# EAGLE design programmer (EAGLE 5.06)
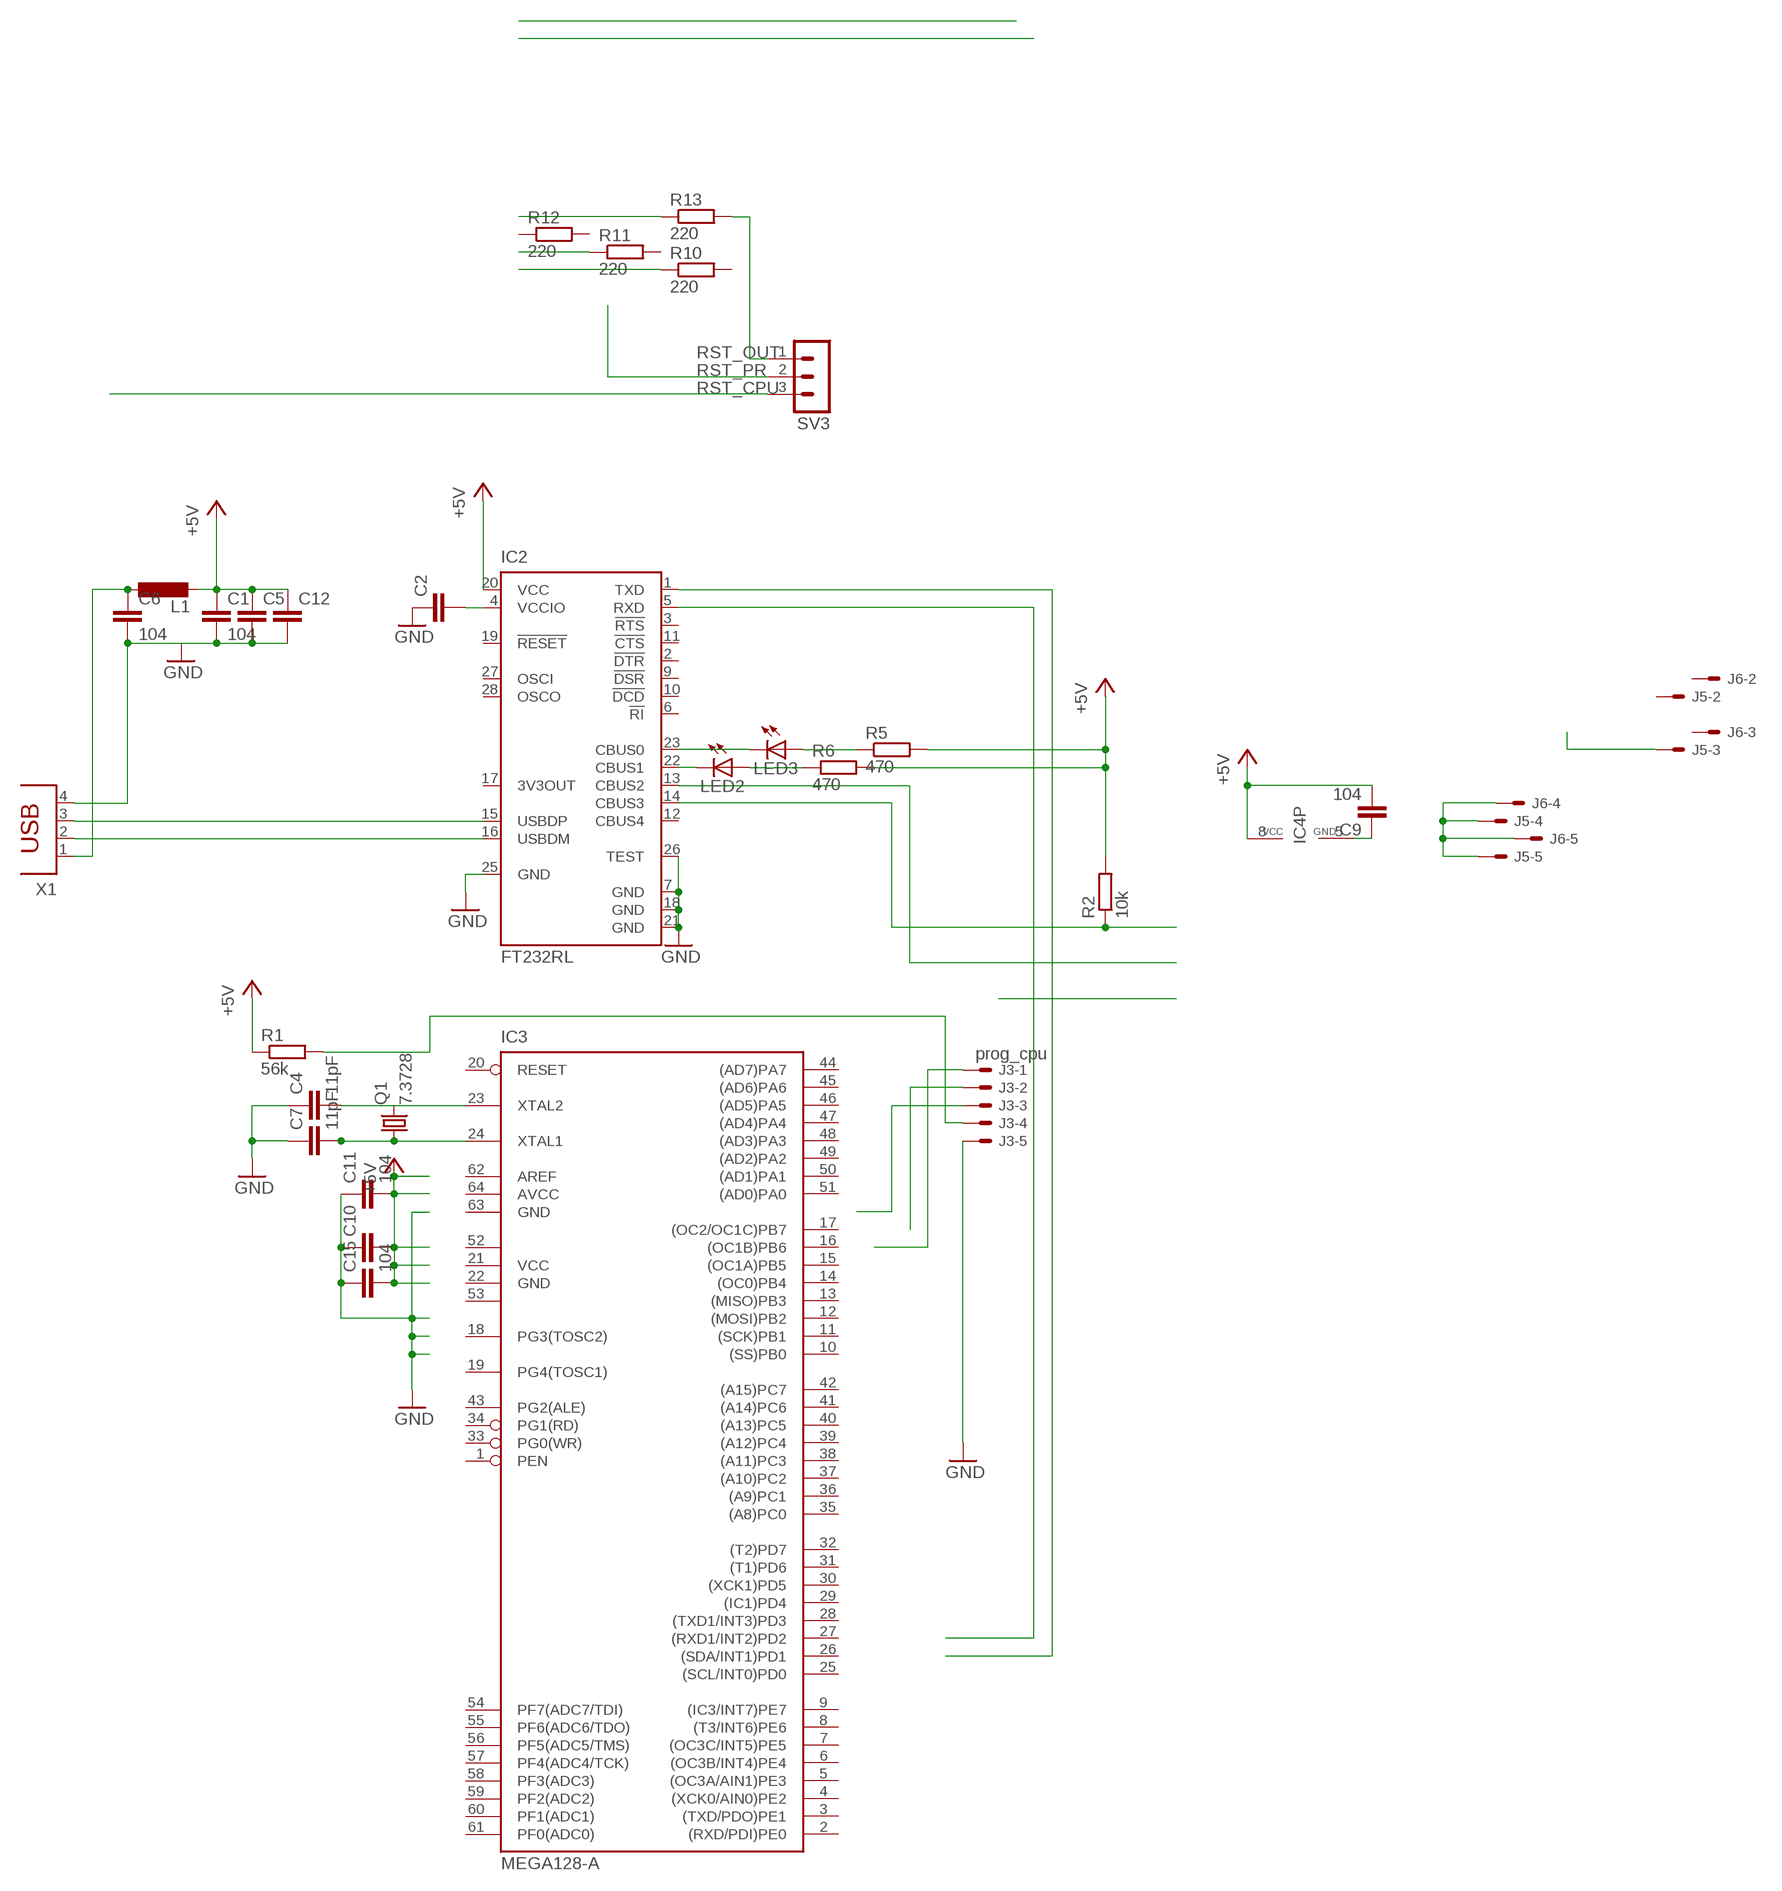
[diagram p0: schematic, sheet 1]

## Parts
C1  104  C-EUC1206  [C1206]
C2  C-EUC1206  [C1206]
C4  11pF  C-EUC1206  [C1206]
C5  C-EUC1206  [C1206]
C6  104  C-EUC1206  [C1206]
C7  11pF  C-EUC1206  [C1206]
C9  104  C-EUC1206  [C1206]
C10  C-EUC1206  [C1206]
C11  104  C-EUC1206  [C1206]
C12  C-EU025-050X050  [C025-050X050]
C15  104  C-EUC1206  [C1206]
IC2  FT232RL  [SSOP28]
IC3  MEGA128-A  [TQFP64]
IC4  MAX481  MAX481CSA  [SO08]
J3  prog_cpu  22-27-2051-05  [6410-05]
J5  22-05-7088-08  [7395-08]
J6  22-27-2081-08  [6410-08]
L1  L-EUL4532C  [L4532M]
LED2  LEDSMT1206  [1206]
LED3  LEDSMT1206  [1206]
Q1  7.3728  CRYTALHC49S  [HC49/S]
R1  56k  R-EU_R1206  [R1206]
R2  10k  R-EU_R1206  [R1206]
R5  470  R-EU_R1206  [R1206]
R6  470  R-EU_R1206  [R1206]
R10  220  R-EU_R1206  [R1206]
R11  220  R-EU_R1206  [R1206]
R12  220  R-EU_R1206  [R1206]
R13  220  R-EU_R1206  [R1206]
SV3  MA03-1  [MA03-1]
X1  PN61729  [PN61729]

## Nets
+5V: C1.1 C5.1 C9.2 C10.2 C11.2 C12.1 C15.2 IC2.20(VCC) IC4.8(VCC) L1.2 R1.1 R2.2 R5.2 R6.2
FT232_V_IN: C2.2 IC2.4(VCCIO)
GND: C1.2 C2.1 C4.1 C5.2 C6.2 C7.1 C10.1 C11.1 C12.2 C15.1 IC2.7(GND) IC2.18(GND) IC2.21(GND) IC2.25(GND) IC2.26(TEST) J3.5 X1.4
N$1: J5.3
N$2: J5.4 J5.5 J6.4 J6.5
N$4: C6.1 L1.1 X1.1
N$5: C4.2 IC3.23(XTAL2)
N$6: R10.1
N$7: C7.2 IC3.24(XTAL1) Q1.1
N$8: J3.4 R1.2
N$11: C9.1 IC4.5(GND)
N$16: IC2.14(CBUS3) R2.1
N$17: R11.1
N$22: IC2.13(CBUS2)
N$31: R13.1
N$32: LED3.A R5.1
N$33: LED2.A R6.1
N$34: IC2.22(CBUS1) LED2.C
N$35: IC2.23(CBUS0) LED3.C
RST_CPU: SV3.3
RST_OUT: R13.2 SV3.1
RST_PR: SV3.2
RXD: IC2.5(RXD)
TCK: J3.3
TDI: J3.1
TDO: J3.2
TXD: IC2.1(TXD)
USB+: IC2.15(USBDP) X1.3
USB-: IC2.16(USBDM) X1.2
Unconnected: IC2.2(!DTR) IC2.3(!RTS) IC2.6(!RI) IC2.9(!DSR) IC2.10(!DCD) IC2.11(!CTS) IC2.12(CBUS4) IC2.17(3V3OUT) IC2.19(!RESET) IC2.27(OSCI) IC2.28(OSCO) IC3.1(PEN) IC3.2((RXD/PDI)PE0) IC3.3((TXD/PDO)PE1) IC3.4((XCK0/AIN0)PE2) IC3.5((OC3A/AIN1)PE3) IC3.6((OC3B/INT4)PE4) IC3.7((OC3C/INT5)PE5) IC3.8((T3/INT6)PE6) IC3.9((IC3/INT7)PE7) IC3.10((SS)PB0) IC3.11((SCK)PB1) IC3.12((MOSI)PB2) IC3.13((MISO)PB3) IC3.14((OC0)PB4) IC3.15((OC1A)PB5) IC3.16((OC1B)PB6) IC3.17((OC2/OC1C)PB7) IC3.18(PG3(TOSC2)) IC3.19(PG4(TOSC1)) IC3.20(RESET) IC3.25((SCL/INT0)PD0) IC3.26((SDA/INT1)PD1) IC3.27((RXD1/INT2)PD2) IC3.28((TXD1/INT3)PD3) IC3.29((IC1)PD4) IC3.30((XCK1)PD5) IC3.31((T1)PD6) IC3.32((T2)PD7) IC3.33(PG0(WR)) IC3.34(PG1(RD)) IC3.35((A8)PC0) IC3.36((A9)PC1) IC3.37((A10)PC2) IC3.38((A11)PC3) IC3.39((A12)PC4) IC3.40((A13)PC5) IC3.41((A14)PC6) IC3.42((A15)PC7) IC3.43(PG2(ALE)) IC3.44((AD7)PA7) IC3.45((AD6)PA6) IC3.46((AD5)PA5) IC3.47((AD4)PA4) IC3.48((AD3)PA3) IC3.49((AD2)PA2) IC3.50((AD1)PA1) IC3.51((AD0)PA0) IC3.54(PF7(ADC7/TDI)) IC3.55(PF6(ADC6/TDO)) IC3.56(PF5(ADC5/TMS)) IC3.57(PF4(ADC4/TCK)) IC3.58(PF3(ADC3)) IC3.59(PF2(ADC2)) IC3.60(PF1(ADC1)) IC3.61(PF0(ADC0)) IC3.62(AREF) IC4.1(RO) IC4.2(RE/) IC4.3(DE) IC4.4(DI) IC4.6(A) IC4.7(B) J5.1 J5.2 J5.6 J5.7 J5.8 J6.1 J6.2 J6.3 J6.6 J6.7 J6.8 Q1.2 R10.2 R11.2 R12.1 R12.2

## Power pins joined to a net without a drawn wire
AVCC: IC3.64(AVCC)
GND: IC3.22(GND) IC3.63(GND)
GND1: IC3.53(GND1)
VCC: IC3.21(VCC)
VCC1: IC3.52(VCC1)

## Library data of the parts
C1 C2 C4-C7 C9-C12 C15 = rcl:C-EU: CAPACITOR, European symbol
IC2 = ftdichip:FT232R: Source: http://www.ftdichip.com/Documents/DataSheets/DS_FT232R_v104.pdf
IC3 = atmel:MEGA128: MICROCONTROLLER 128 Kbytes FLASH 4 Kbytes SRAM 4 Kbytes EEPROM DUAL USART 8-channel 10 bit ADC Source: avr.lbr
IC4 = maxim:MAX481CSA: RS485 TRANSEIVER
J3 = con-molex:22-?-05: CONNECTOR wire to board 2.54 mm (.1 inch) pitch header
J5 J6 = con-molex:22-?-08: CONNECTOR wire to board 2.54 mm (.1 inch) pitch header
L1 = rcl:L-EU: INDUCTOR, European symbol
LED2 LED3 = led:LED: LED OSRAM: - CHIPLED LG R971, LG N971, LY N971, LG Q971, LY Q971, LO R971, LY R971 LH N974, LH R974 LS Q976, LO Q976, LY Q976 LO Q996 - Hyper CHIPLED LW Q18S LB Q993, LB Q99A, LB R99A - SideLED LS A670, LO A670, LY A670, LG A670, LP A670 LB A673, LV A673, LT A673, LW A673 LH A674 LY A675 LS A676, LA A676, LO A676, LY A676, LW A676 LS A679, LY A679, LG A679 - Hyper Micro SIDELED® LS Y876, LA Y876, LO Y876, LY Y876 LT Y87S - SmartLED LW L88C, LW L88S LB L89C, LB L89S, LG L890 LS L89K, LO L89K, LY L89K LS L896, LA L896, LO L896, LY L896 - TOPLED LS T670, LO T670, LY T670, LG T670, LP T670 LSG T670, LSP T670, LSY T670, LOP T670, LYG T670 LG T671, LOG T671, LSG T671 LB T673, LV T673, LT T673, LW T673 LH T674 LS T676, LA T676, LO T676, LY T676, LB T676, LH T676, LSB T676, LW T676 LB T67C, LV T67C, LT T67C, LS T67K, LO T67K, LY T67K, LW E67C LS E67B, LA E67B, LO E67B, LY E67B, LB E67C, LV E67C, LT E67C LW T67C LS T679, LY T679, LG T679 LS T770, LO T770, LY T770, LG T770, LP T770 LB T773, LV T773, LT T773, LW T773 LH T774 LS E675, LA E675, LY E675, LS T675 LS T776, LA T776, LO T776, LY T776, LB T776 LHGB T686 LT T68C, LB T68C - Hyper Mini TOPLED® LB M676 - Mini TOPLED Santana® LG M470 LS M47K, LO M47K, LY M47K Source: http://www.osram.convergy.de LUXEON: - LUMILED® LXK2-PW12-R00, LXK2-PW12-S00, LXK2-PW14-U00, LXK2-PW14-V00 LXK2-PM12-R00, LXK2-PM12-S00, LXK2-PM14-U00 LXK2-PE12-Q00, LXK2-PE12-R00, LXK2-PE12-S00, LXK2-PE14-T00, LXK2-PE14-U00 LXK2-PB12-K00, LXK2-PB12-L00, LXK2-PB12-M00, LXK2-PB14-N00, LXK2-PB14-P00, LXK2-PB14-Q00 LXK2-PR12-L00, LXK2-PR12-M00, LXK2-PR14-Q00, LXK2-PR14-R00 LXK2-PD12-Q00, LXK2-PD12-R00, LXK2-PD12-S00 LXK2-PH12-R00, LXK2-PH12-S00 LXK2-PL12-P00, LXK2-PL12-Q00, LXK2-PL12-R00 Source: www.luxeon.com KINGBRIGHT: KA-3528ASYC Source: www.kingbright.com
Q1 = crystal:CRYTAL: CRYSTAL
R1 R2 R5 R6 R10-R13 = rcl:R-EU_: RESISTOR, European symbol
SV3 = con-lstb:MA03-1: PIN HEADER
X1 = con-berg:PN61729: BERG USB connector

## Board
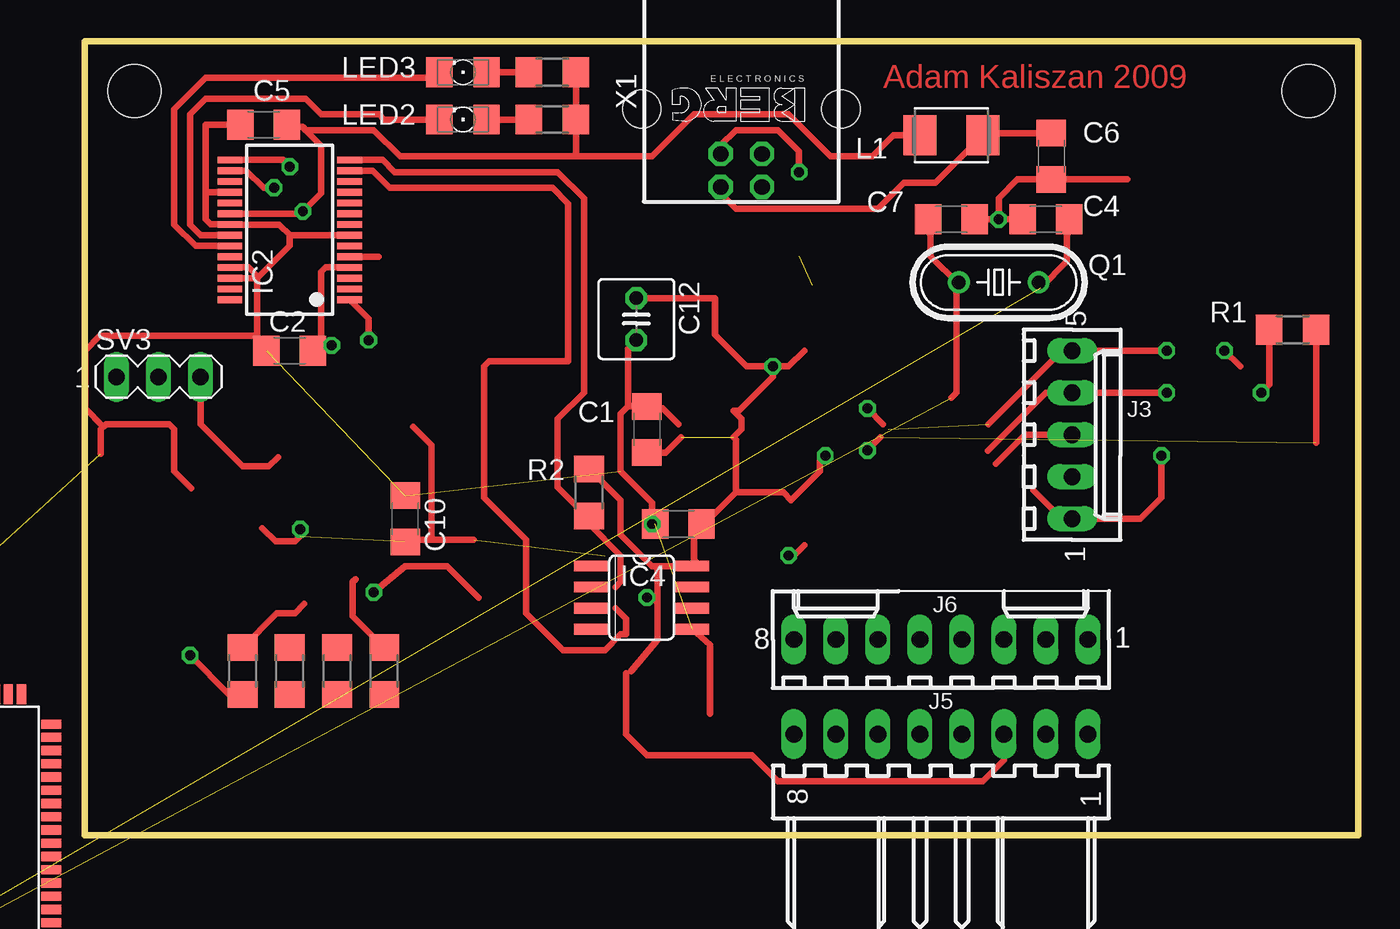
[diagram p1: board, top side]
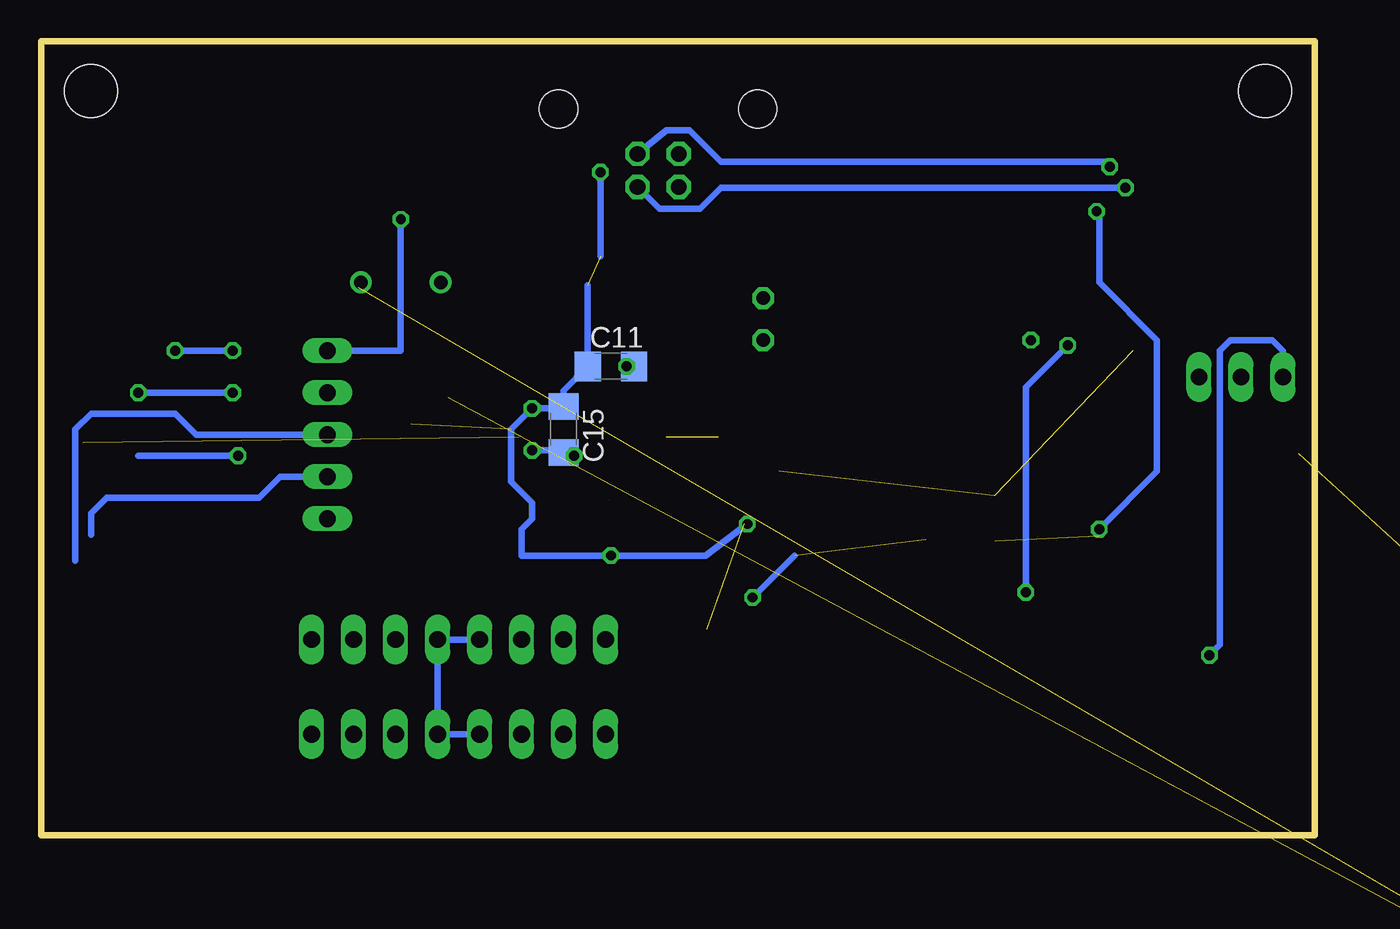
[diagram p2: board, bottom side, seen from below]

Size 77 x 48 mm. Coordinates in mm from the lower left corner, seen from the top.
Outline: 0,0 0,48 77,48 77,0 0,0
Copper layers (1*16): Top 0.035mm / dielectric 1.5mm / Bottom 0.035mm
Design rules "default": minimum track width 10mil, minimum drill 12mil, track to track 8mil, track to pad 8mil, pad to pad 8mil, via to via 8mil, smd to smd 0mil, copper to edge 0mil, drill to drill 8mil, minimum pad ring 10mil, minimum via ring 8mil, stop-mask expansion 4mil, vias tented up to drill 0mil, thermal gap 10mil
Holes 3.2 mm at 3,45 74,45

### Footprints (pad centres in the part's own frame; a part is rotated, then mirrored left to right if it is on the bottom)
C1206 = smd 1.6 x 1.8: 1 -1.4,0; 2 1.4,0
C025-050X050 = drill 0.813 octagon: 1 -1.27,0; 2 1.27,0
SSOP28 = smd 0.4 x 1.5: 1 -4.225,-3.625; 2 -3.575,-3.625; 3 -2.925,-3.625; 4 -2.275,-3.625; 5 -1.625,-3.625; 6 -0.975,-3.625; 7 -0.325,-3.625; 8 0.325,-3.625; 9 0.975,-3.625; 10 1.625,-3.625; 11 2.275,-3.625; 12 2.925,-3.625; 13 3.575,-3.625; 14 4.225,-3.625; 15 4.225,3.625; 16 3.575,3.625; 17 2.925,3.625; 18 2.275,3.625; 19 1.625,3.625; 20 0.975,3.625; 21 0.325,3.625; 22 -0.325,3.625; 23 -0.975,3.625; 24 -1.625,3.625; 25 -2.275,3.625; 26 -2.925,3.625; 27 -3.575,3.625; 28 -4.225,3.625
TQFP64 = smd 1.194 x 0.559: 1 -7.8,6; 2 -7.8,5.2; 3 -7.8,4.4; 4 -7.8,3.6; 5 -7.8,2.8; 6 -7.8,2; 7 -7.8,1.2; 8 -7.8,0.4; 9 -7.8,-0.4; 10 -7.8,-1.2; 11 -7.8,-2; 12 -7.8,-2.8; 13 -7.8,-3.6; 14 -7.8,-4.4; 15 -7.8,-5.2; 16 -7.8,-6; 33 7.8,-6; 34 7.8,-5.2; 35 7.8,-4.4; 36 7.8,-3.6; 37 7.8,-2.8; 38 7.8,-2; 39 7.8,-1.2; 40 7.8,-0.4; 41 7.8,0.4; 42 7.8,1.2; 43 7.8,2; 44 7.8,2.8; 45 7.8,3.6; 46 7.8,4.4; 47 7.8,5.2; 48 7.8,6 | smd 0.559 x 1.194: 17 -6,-7.8; 18 -5.2,-7.8; 19 -4.4,-7.8; 20 -3.6,-7.8; 21 -2.8,-7.8; 22 -2,-7.8; 23 -1.2,-7.8; 24 -0.4,-7.8; 25 0.4,-7.8; 26 1.2,-7.8; 27 2,-7.8; 28 2.8,-7.8; 29 3.6,-7.8; 30 4.4,-7.8; 31 5.2,-7.8; 32 6,-7.8; 49 6,7.8; 50 5.2,7.8; 51 4.4,7.8; 52 3.6,7.8; 53 2.8,7.8; 54 2,7.8; 55 1.2,7.8; 56 0.4,7.8; 57 -0.4,7.8; 58 -1.2,7.8; 59 -2,7.8; 60 -2.8,7.8; 61 -3.6,7.8; 62 -4.4,7.8; 63 -5.2,7.8; 64 -6,7.8
SO08 = smd 0.66 x 2.032: 1 -1.905,-3.073; 2 -0.635,-3.073; 3 0.635,-3.073; 4 1.905,-3.073; 5 1.905,3.073; 6 0.635,3.073; 7 -0.635,3.073; 8 -1.905,3.073
6410-05 = drill 1.016 long: 1 5.08,0; 2 2.54,0; 3 0,0; 4 -2.54,0; 5 -5.08,0
7395-08 = drill 1.016 long: 1 8.89,0; 2 6.35,0; 3 3.81,0; 4 1.27,0; 5 -1.27,0; 6 -3.81,0; 7 -6.35,0; 8 -8.89,0
6410-08 = drill 1.016 long: 1 8.89,0; 2 6.35,0; 3 3.81,0; 4 1.27,0; 5 -1.27,0; 6 -3.81,0; 7 -6.35,0; 8 -8.89,0
L4532M = smd 2 x 2.4: 1 -1.9,0; 2 1.9,0
1206 = smd 1.6 x 1.803: A -1.422,0; C 1.422,0
HC49/S = drill 0.813 round: 1 -2.413,0; 2 2.413,0
R1206 = smd 1.6 x 1.803: 1 -1.422,0; 2 1.422,0
MA03-1 = drill 1.016 long: 1 -2.54,0; 2 0,0; 3 2.54,0
PN61729 = drill 0.95 octagon: 1 1.25,4.71; 2 -1.25,4.71; 3 -1.25,2.71; 4 1.25,2.71 | hole 2.3: -6.02,0; 6.02,0

### Placement (x,y rotation side)
C1  33.99,24.54 90 top
C2  12.4,29.3 0 top
C4  58.12,37.24 0 top
C5  10.81,42.96 180 top
C6  58.44,41.05 270 top
C7  52.41,37.24 180 top
C9  35.9,18.83 0 top
C10  19.38,19.14 270 top
C11  42.56,28.35 0 bottom
C12  33.35,31.21 270 top
C15  45.42,24.54 270 bottom
IC2  12.4,36.61 90 top
IC3  -9.82,0.73 0 top
IC4  33.67,14.38 270 top
J3  59.71,24.23 270 top
J5  51.77,6.13 0 top
J6  51.77,11.84 0 top
L1  52.41,42.32 180 top
LED2  22.88,43.27 180 top
LED3  22.88,46.13 180 top
Q1  55.26,33.43 0 top
R1  73.04,30.57 180 top
R2  30.5,20.73 90 top
R5  28.27,46.13 0 top
R6  28.27,43.27 0 top
R10  18.11,9.94 270 top
R11  15.26,9.94 270 top
R12  12.4,9.94 270 top
R13  9.54,9.94 270 top
SV3  4.46,27.72 0 top
X1  39.7,43.91 180 top

### Tracks (layer width: path | path; a pad name or v marks a point on that pad's centre or on a via)
+5V  (via drill 0.6)  (6 unrouted)
  Top 0.406: 33.04,9.94 34.62,11.84 34.62,14.06 | 34.62,14.06 34.62,16.29 | 34.62,16.29 IC4.8 36.98,16.52 36.85,16.52 36.85,18.83 C9.2 37.48,18.83 39.39,20.73 | 74.47,23.74 R1.1 | v47.33,23.27 48.11,24.06 | 43.52,29.3 42.56,28.35 v41.61,28.35 | 39.39,20.73 42.24,20.73 42.72,20.26 | 42.72,20.25 44.47,22 44.47,22.64 v44.78,22.95 | 39.22,24.06 39.7,24.54 39.7,25.18 39.22,25.66 39.55,25.66 41.61,27.72 v41.61,28.35 | 39.23,24.06 39.39,23.91 39.39,20.73 | C1.1 35.13,23.14 36.05,24.06 | 10.74,18.58 11.54,17.78 12.72,17.78 13.04,18.1 v13.04,18.51 | 34.62,16.29 34.31,16.29 32.4,18.19 32.4,20.25 R2.2 | 19.35,17.78 C10.2 19.52,17.88 20.97,17.88 | v41.61,28.35 C11.2 40.02,28.35 38.12,30.26 38.12,32.48 C12.1 | 19.85,24.71 20.97,23.59 20.97,17.88 | 20.97,17.88 23.51,17.88 | IC2.20 13.06,37.58 v13.19,37.72 14.3,38.83 14.3,41.69 13.35,42.64 | 13.35,42.64 13.16,42.83 12.08,42.83 C5.1 12.08,43.09 | v33.99,14.38 34.31,14.38 34.62,14.06 | L1.2 48.91,42.32 47.64,41.05 45.1,41.05 42.56,43.59 36.85,43.59 34.31,41.05 29.55,41.05 | 13.35,42.64 17.48,42.64 19.07,41.05 29.55,41.05 | 29.55,41.05 29.7,41.2 R6.2 R5.2
  Bottom 0.406: v47.33,23.27 45.55,23.27 C15.2 45.29,23.27 v44.78,22.95 | v41.61,28.35 C11.2 | 13.04,18.83 v13.04,18.51 9.54,22 9.54,29.94 13.04,33.43 13.04,37.56 v13.19,37.72 | v33.99,14.38 31.45,16.92
FT232_V_IN  (via drill 0.6)
  Top 0.406: 23.83,14.38 21.92,16.29 19.38,16.29 v17.48,14.7 | v14.94,29.62 14.3,29.62 | 14.3,29.62 C2.2 | IC2.4 14.57,34.33 14.3,34.07 14.3,29.62
  Bottom 0.406: v17.48,14.7 17.48,27.08 v14.94,29.62
GND  (via drill 0.6)  (6 unrouted)
  Top 0.406: 54.63,24.86 59.07,29.3 J3.5 v65.42,29.3 | v55.26,37.24 C7.1 | v68.92,29.3 69.87,28.35 | v55.26,37.24 C4.1 | v47.33,25.81 48.28,24.86 | 43.52,17.56 42.88,16.92 v42.56,16.92 | 34.31,18.7 v34.31,18.83 34.31,20.1 32.4,22 32.4,25.5 32.85,25.94 | 35.9,24.86 34.94,25.81 34.12,25.81 C1.2 32.85,25.94 | 6.44,20.98 5.41,22 5.41,24.54 5.1,24.86 1.29,24.86 1.13,24.7 | 1.13,24.7 0.97,24.54 0.97,23.09 | C10.1 19.02,20.18 | 12.41,36.28 IC2.7 | 12.41,36.28 11.77,36.92 9.23,36.92 9.22,36.93 IC2.21 7.63,36.93 7.32,37.24 7.32,39 | 10.43,33.68 10.5,33.75 9.91,34.33 IC2.25 | 10.43,33.68 IC2.26 | 10.43,33.68 12.4,35.66 12.4,36.27 12.41,36.28 | 10.43,30.2 10.43,33.68 | 10.43,30.2 C2.1 | 10.43,30.2 0.91,30.2 0.02,29.3 0.02,25.81 1.13,24.7 | C5.2 7.32,42.96 7.32,39 | v55.26,37.24 55.26,38.51 56.4,39.65 C6.2 63.06,39.65 | X1.4 38.45,41.71 39.39,42.64 41.93,42.64 43.2,41.37 v43.2,40.1 | 32.85,25.94 32.85,29.43 C12.2 | IC2.18 7.44,38.88 7.32,39
  Bottom 0.406: v65.42,29.3 v68.92,29.3 | v55.26,37.24 55.26,29.3 J3.5 | 43.96,33.25 C11.1 45.42,26.89 C15.1 45.55,25.81 v47.33,25.81 48.59,24.54 48.59,21.37 47.33,20.1 47.33,19.14 47.96,18.51 47.96,16.92 v42.56,16.92 36.85,16.92 v34.31,18.83 | v43.2,40.1 43.2,35.02
N$1
  Top 0.406: 32.72,9.81 32.72,6.13 33.99,4.86 40.34,4.86 41.93,3.27 54.31,3.27 55.58,4.54 J5.3
N$2
  Bottom 0.406: J6.5 J6.4 J5.4 J5.5
N$4
  Top 0.406: C6.1 54.44,42.45 L1.1 51.45,39.47 49.55,39.47 47.96,37.88 39.39,37.88 38.45,38.81 X1.1
N$5  (1 unrouted)
  Top 0.406: 57.8,33.11 59.39,34.7 59.39,36.16 C4.2
N$6
  Top 0.406: 16.38,15.5 16.21,15.34 16.21,13.26 R10.1
N$7  (1 unrouted)
  Top 0.406: C7.2 51.14,36.16 51.14,35.02 52.85,33.3 Q1.1 52.72,33.3 52.72,26.77 52.42,26.46
N$8  (via drill 0.6)
  Top 0.406: 54.61,23.26 58.12,26.77 J3.4 v65.42,26.77 | R1.2 71.62,27.25 v71.14,26.77
  Bottom 0.406: v65.42,26.77 v71.14,26.77
N$11  (1 unrouted)
  Top 0.406: IC4.5 37.8,11.53 37.8,9.94 37.8,7.36
N$16
  Top 0.406: 32.09,15.02 32.4,15.34 32.4,16.92 30.5,18.83 30.35,19.46 R2.1 30.03,18.83 30.5,19.14 28.59,21.05 28.59,25.18 30.18,26.77 30.18,38.51 28.59,40.1 18.75,40.1 18.02,40.83 IC2.14
N$17
  Top 0.406: 14.88,11.73 R11.1
N$22
  Top 0.406: IC2.13 17.4,40.18 18.43,39.15 28.27,39.15 29.23,38.2 29.23,28.67 24.47,28.67 24.15,28.35 24.15,20.41 26.69,17.88 26.69,13.43 28.91,11.21 31.45,11.21 32.4,12.16 32.72,12.16 32.72,13.11 32.09,13.75
N$31
  Top 0.406: 13.28,13.99 12.72,13.43 11.61,13.43 R13.1
N$32
  Top 0.406: LED3.A R5.1
N$33
  Top 0.406: LED2.A R6.1
N$34
  Top 0.406: IC2.22 7.01,36.28 6.37,36.92 6.37,43.59 7.32,44.55 13.35,44.55 14.3,43.59 17.8,43.59 18.11,43.27 LED2.C
N$35
  Top 0.406: IC2.23 6.71,35.63 5.41,36.92 5.41,43.91 7.32,45.81 21.14,45.81 LED3.C
RST_CPU
  Top 0.406: 11.68,22.87 11.13,22.32 9.54,22.32 7,24.86 SV3.3
RST_OUT  (via drill 0.6)
  Top 0.406: R13.2 8.74,8.52 v6.37,10.89
  Bottom 0.406: v6.37,10.89 5.73,11.53 5.73,29.3 5.1,29.94 2.56,29.94 1.92,29.3 SV3.1
RST_PR
  Bottom 0.406: SV3.2 4.78,27.4
RXD
  Top 0.406: IC2.5 17.76,34.98
TCK
  Top 0.406: 55.08,22.46 56.85,24.23 J3.3
  Bottom 0.406: J3.3 67.64,24.23 68.92,25.5 74,25.5 74.95,24.54 74.95,16.61
TDI  (via drill 0.6)
  Top 0.406: 57.36,20.86 59.07,19.14 J3.1 63.83,19.14 65.11,20.41 v65.11,22.95
  Bottom 0.406: v65.11,22.95 71.14,22.95
TDO
  Top 0.406: J3.2 59.68,21.66
  Bottom 0.406: J3.2 62.56,21.68 63.83,20.41 73.04,20.41 74,19.46 74,18.19
TXD  (via drill 0.6)
  Top 0.406: v17.16,29.94 17.16,31.25 IC2.1
USB+  (via drill 0.6)
  Top 0.406: IC2.15 11.98,40.83 v12.4,40.42
  Bottom 0.406: v12.4,40.42 12.72,40.73 35.9,40.73 37.8,42.64 39.2,42.64 X1.3
USB-  (via drill 0.6)
  Top 0.406: IC2.16 9.78,40.18 10.81,39.15 v11.45,39.15
  Bottom 0.406: v11.45,39.15 35.9,39.15 37.16,37.88 39.63,37.88 X1.2

### Text on the board
Top: Adam Kaliszan 2009